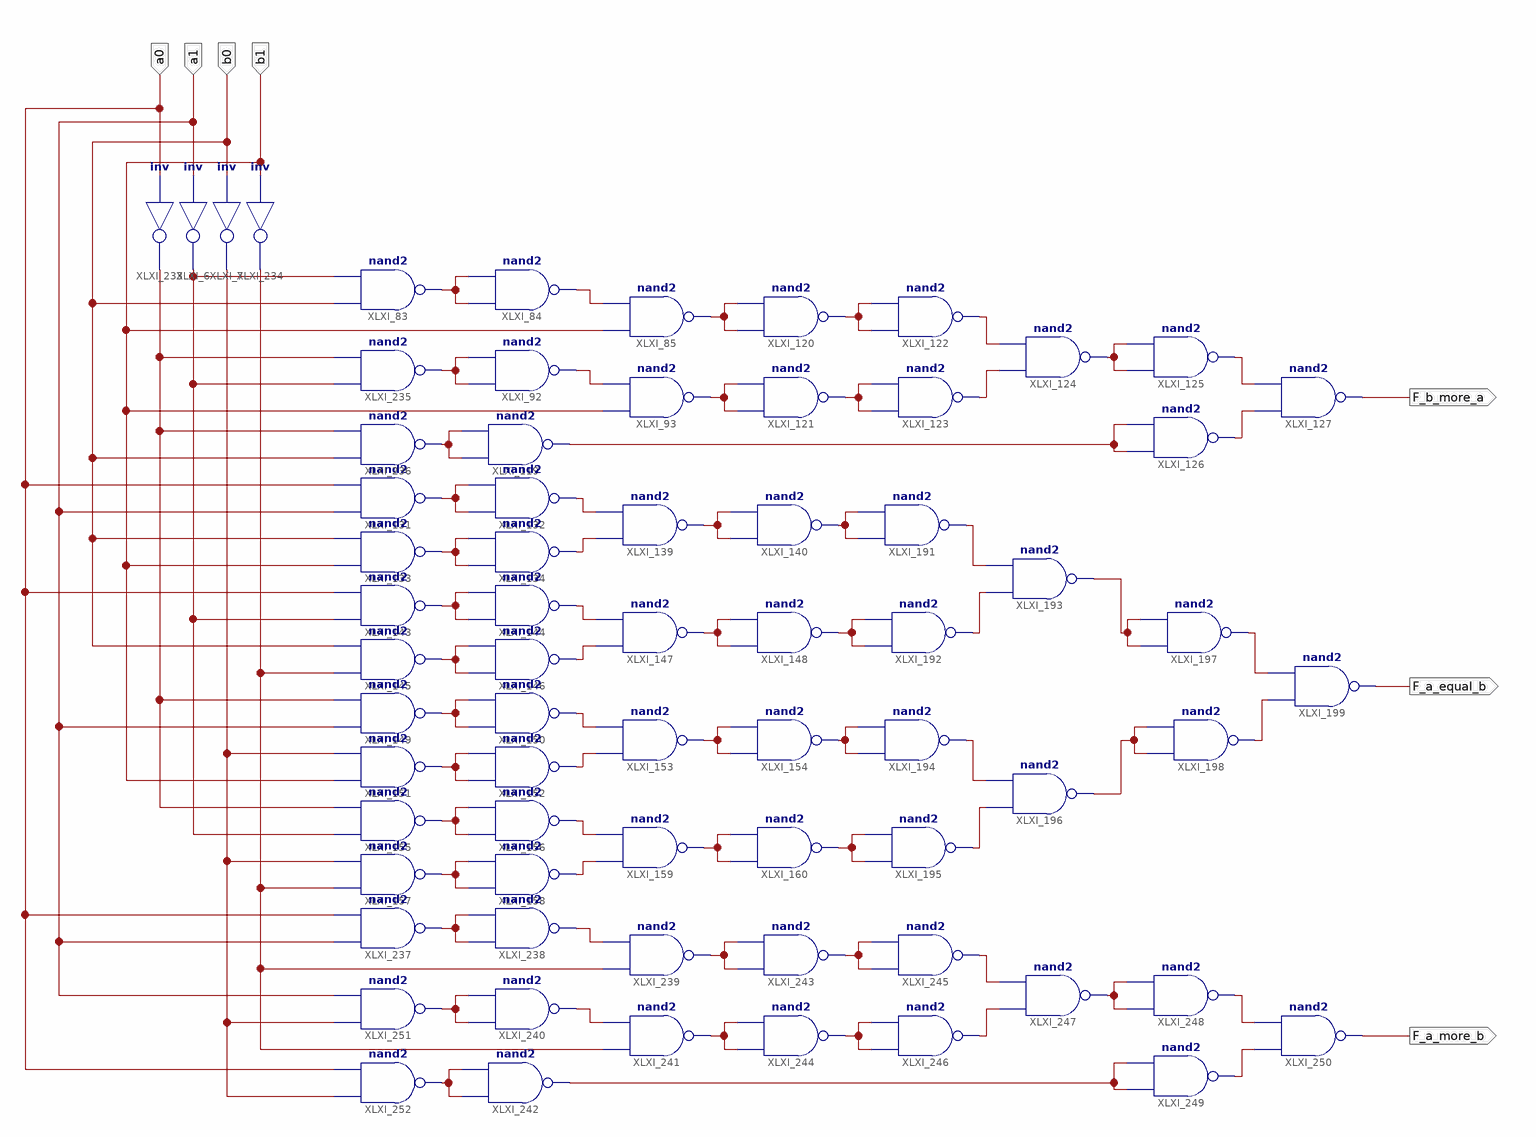
[diagram p0: schematic sheet 1]
// Xilinx ISE schematic comparator_circuit.sch (artix7) as structural Verilog: 69 symbols, 7 ports
module comparator_circuit (
  input  b0,
  input  a0,
  input  a1,
  input  b1,
  output F_b_more_a,
  output F_a_equal_b,
  output F_a_more_b
);

  wire XLXN_18, XLXN_19, XLXN_423, XLXN_425, XLXN_432, XLXN_433, XLXN_468, XLXN_470, XLXN_472, XLXN_475,
       XLXN_477, XLXN_479, XLXN_480, XLXN_481, XLXN_482, XLXN_486, XLXN_489, XLXN_497, XLXN_499, XLXN_503,
       XLXN_506, XLXN_507, XLXN_508, XLXN_509, XLXN_510, XLXN_511, XLXN_512, XLXN_513, XLXN_514, XLXN_515,
       XLXN_516, XLXN_517, XLXN_518, XLXN_519, XLXN_520, XLXN_521, XLXN_522, XLXN_548, XLXN_550, XLXN_553,
       XLXN_554, XLXN_555, XLXN_556, XLXN_558, XLXN_559, XLXN_560, XLXN_561, XLXN_563, XLXN_564, XLXN_603,
       XLXN_606, XLXN_608, XLXN_609, XLXN_610, XLXN_611, XLXN_612, XLXN_613, XLXN_614, XLXN_615, XLXN_616,
       XLXN_617, XLXN_618, XLXN_619, XLXN_620, XLXN_621, XLXN_623;

  not XLXI_6 (XLXN_18, a1);
  not XLXI_7 (XLXN_19, b0);
  nand XLXI_83 (XLXN_423, b0, XLXN_18);
  nand XLXI_84 (XLXN_425, XLXN_423, XLXN_423);
  nand XLXI_85 (XLXN_470, b1, XLXN_425);
  nand XLXI_92 (XLXN_433, XLXN_432, XLXN_432);
  nand XLXI_93 (XLXN_472, b1, XLXN_433);
  nand XLXI_119 (XLXN_489, XLXN_468, XLXN_468);
  nand XLXI_120 (XLXN_475, XLXN_470, XLXN_470);
  nand XLXI_121 (XLXN_477, XLXN_472, XLXN_472);
  nand XLXI_122 (XLXN_480, XLXN_475, XLXN_475);
  nand XLXI_123 (XLXN_479, XLXN_477, XLXN_477);
  nand XLXI_124 (XLXN_486, XLXN_479, XLXN_480);
  nand XLXI_125 (XLXN_482, XLXN_486, XLXN_486);
  nand XLXI_126 (XLXN_481, XLXN_489, XLXN_489);
  nand XLXI_127 (F_b_more_a, XLXN_481, XLXN_482);
  nand XLXI_131 (XLXN_497, a1, a0);
  nand XLXI_132 (XLXN_506, XLXN_497, XLXN_497);
  nand XLXI_133 (XLXN_499, b1, b0);
  nand XLXI_134 (XLXN_507, XLXN_499, XLXN_499);
  nand XLXI_139 (XLXN_503, XLXN_507, XLXN_506);
  nand XLXI_140 (XLXN_548, XLXN_503, XLXN_503);
  nand XLXI_143 (XLXN_508, XLXN_18, a0);
  nand XLXI_144 (XLXN_511, XLXN_508, XLXN_508);
  nand XLXI_145 (XLXN_509, XLXN_606, b0);
  nand XLXI_146 (XLXN_512, XLXN_509, XLXN_509);
  nand XLXI_147 (XLXN_510, XLXN_512, XLXN_511);
  nand XLXI_148 (XLXN_550, XLXN_510, XLXN_510);
  nand XLXI_149 (XLXN_513, a1, XLXN_603);
  nand XLXI_150 (XLXN_516, XLXN_513, XLXN_513);
  nand XLXI_151 (XLXN_514, b1, XLXN_19);
  nand XLXI_152 (XLXN_517, XLXN_514, XLXN_514);
  nand XLXI_153 (XLXN_515, XLXN_517, XLXN_516);
  nand XLXI_154 (XLXN_555, XLXN_515, XLXN_515);
  nand XLXI_155 (XLXN_518, XLXN_18, XLXN_603);
  nand XLXI_156 (XLXN_521, XLXN_518, XLXN_518);
  nand XLXI_157 (XLXN_519, XLXN_606, XLXN_19);
  nand XLXI_158 (XLXN_522, XLXN_519, XLXN_519);
  nand XLXI_159 (XLXN_520, XLXN_522, XLXN_521);
  nand XLXI_160 (XLXN_556, XLXN_520, XLXN_520);
  nand XLXI_191 (XLXN_554, XLXN_548, XLXN_548);
  nand XLXI_192 (XLXN_553, XLXN_550, XLXN_550);
  nand XLXI_193 (XLXN_560, XLXN_553, XLXN_554);
  nand XLXI_194 (XLXN_559, XLXN_555, XLXN_555);
  nand XLXI_195 (XLXN_558, XLXN_556, XLXN_556);
  nand XLXI_196 (XLXN_561, XLXN_558, XLXN_559);
  nand XLXI_197 (XLXN_564, XLXN_560, XLXN_560);
  nand XLXI_198 (XLXN_563, XLXN_561, XLXN_561);
  nand XLXI_199 (F_a_equal_b, XLXN_563, XLXN_564);
  not XLXI_233 (XLXN_603, a0);
  not XLXI_234 (XLXN_606, b1);
  nand XLXI_235 (XLXN_432, XLXN_18, XLXN_603);
  nand XLXI_236 (XLXN_468, b0, XLXN_603);
  nand XLXI_237 (XLXN_608, a1, a0);
  nand XLXI_238 (XLXN_609, XLXN_608, XLXN_608);
  nand XLXI_239 (XLXN_613, XLXN_606, XLXN_609);
  nand XLXI_240 (XLXN_611, XLXN_610, XLXN_610);
  nand XLXI_241 (XLXN_614, XLXN_606, XLXN_611);
  nand XLXI_242 (XLXN_623, XLXN_612, XLXN_612);
  nand XLXI_243 (XLXN_615, XLXN_613, XLXN_613);
  nand XLXI_244 (XLXN_616, XLXN_614, XLXN_614);
  nand XLXI_245 (XLXN_618, XLXN_615, XLXN_615);
  nand XLXI_246 (XLXN_617, XLXN_616, XLXN_616);
  nand XLXI_247 (XLXN_621, XLXN_617, XLXN_618);
  nand XLXI_248 (XLXN_620, XLXN_621, XLXN_621);
  nand XLXI_249 (XLXN_619, XLXN_623, XLXN_623);
  nand XLXI_250 (F_a_more_b, XLXN_619, XLXN_620);
  nand XLXI_251 (XLXN_610, XLXN_19, a1);
  nand XLXI_252 (XLXN_612, XLXN_19, a0);
endmodule
